# Altium project motor2.PrjPcb
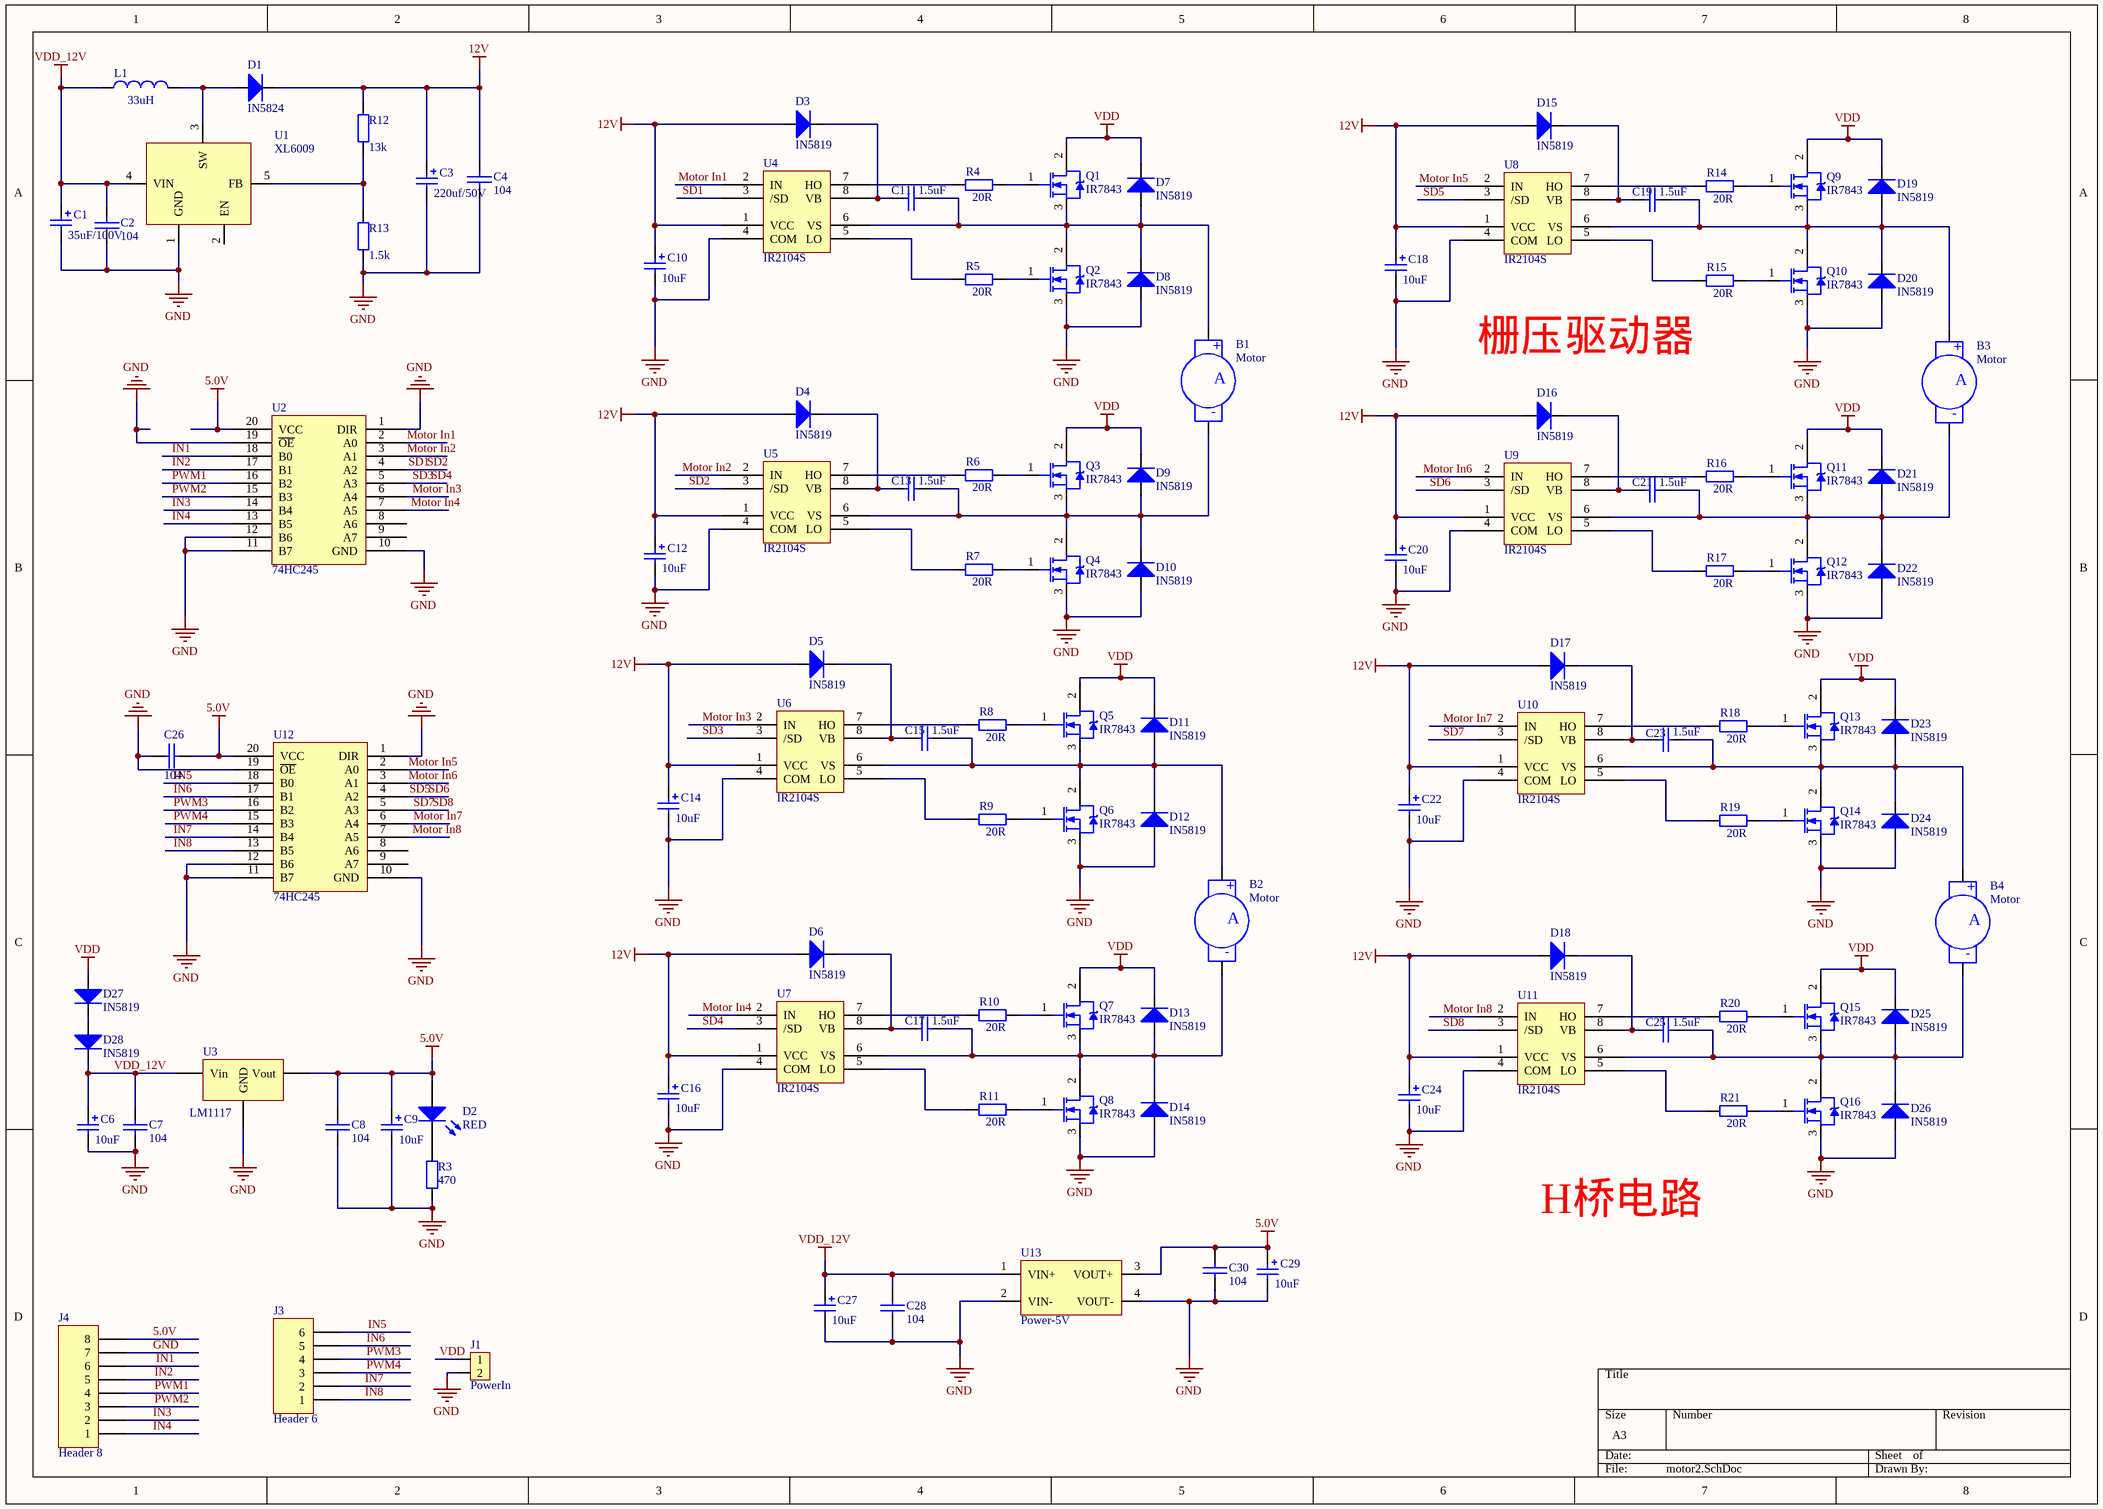
[diagram p0: motor2.SchDoc]
1 sheet, 113 parts. Net scope: global (net labels, ports and power ports of the same name join across sheets).
Board file: motor2.PcbDoc

## Sheet motor2.SchDoc
size A3

### Parts
B1  Motor  [Con 2接线端子]
B2  Motor  [Con 2接线端子]
B3  Motor  [Con 2接线端子]
B4  Motor  [Con 2接线端子]
C1  value 35uF/100V  [C6X12]  (hidden comment: Cap Pol1)
C2  104  [0805C]
C3  value 220uf/50V  [C8X12]  (hidden comment: Cap Pol1)
C4  104  [0805C]
C6  value 10uF  [3216]  (hidden comment: Cap Pol1)
C7  104  [0805c]
C8  104  [0805c]
C9  value 10uF  [3216]  (hidden comment: Cap Pol1)
C10  value 10uF  [3216]  (hidden comment: Cap Pol1)
C11  1.5uF  [0805C]
C12  value 10uF  [3216]  (hidden comment: Cap Pol1)
C13  1.5uF  [0805C]
C14  value 10uF  [3216]  (hidden comment: Cap Pol1)
C15  1.5uF  [0805C]
C16  value 10uF  [3216]  (hidden comment: Cap Pol1)
C17  1.5uF  [0805C]
C18  value 10uF  [3216]  (hidden comment: Cap Pol1)
C19  1.5uF  [0805C]
C20  value 10uF  [3216]  (hidden comment: Cap Pol1)
C21  1.5uF  [0805C]
C22  value 10uF  [3216]  (hidden comment: Cap Pol1)
C23  1.5uF  [0805C]
C24  value 10uF  [3216]  (hidden comment: Cap Pol1)
C25  1.5uF  [0805C]
C26  104  [0805C]
C27  value 10uF  [3216]  (hidden comment: Cap Pol1)
C28  104  [0805c]
C29  value 10uF  [3216]  (hidden comment: Cap Pol1)
C30  104  [0805c]
D1  IN5824  [DO-214  贴片二极管]
D2  RED  [3MM_LED]
D3  IN5819  [DO-214  贴片二极管]
D4  IN5819  [DO-214  贴片二极管]
D5  IN5819  [DO-214  贴片二极管]
D6  IN5819  [DO-214  贴片二极管]
D7  IN5819  [DO-214  贴片二极管]
D8  IN5819  [DO-214  贴片二极管]
D9  IN5819  [DO-214  贴片二极管]
D10  IN5819  [DO-214  贴片二极管]
D11  IN5819  [DO-214  贴片二极管]
D12  IN5819  [DO-214  贴片二极管]
D13  IN5819  [DO-214  贴片二极管]
D14  IN5819  [DO-214  贴片二极管]
D15  IN5819  [DO-214  贴片二极管]
D16  IN5819  [DO-214  贴片二极管]
D17  IN5819  [DO-214  贴片二极管]
D18  IN5819  [DO-214  贴片二极管]
D19  IN5819  [DO-214  贴片二极管]
D20  IN5819  [DO-214  贴片二极管]
D21  IN5819  [DO-214  贴片二极管]
D22  IN5819  [DO-214  贴片二极管]
D23  IN5819  [DO-214  贴片二极管]
D24  IN5819  [DO-214  贴片二极管]
D25  IN5819  [DO-214  贴片二极管]
D26  IN5819  [DO-214  贴片二极管]
D27  IN5819  [DO-214  贴片二极管]
D28  IN5819  [DO-214  贴片二极管]
J1  PowerIn  [T型公头]
J3  Header 6  [PH2.0-6P]
J4  Header 8  [PH2.0-8P]
L1  value 33uH  [L33uf]  (hidden comment: Inductor)
Q1  IR7843  [TO-252]
Q2  IR7843  [TO-252]
Q3  IR7843  [TO-252]
Q4  IR7843  [TO-252]
Q5  IR7843  [TO-252]
Q6  IR7843  [TO-252]
Q7  IR7843  [TO-252]
Q8  IR7843  [TO-252]
Q9  IR7843  [TO-252]
Q10  IR7843  [TO-252]
Q11  IR7843  [TO-252]
Q12  IR7843  [TO-252]
Q13  IR7843  [TO-252]
Q14  IR7843  [TO-252]
Q15  IR7843  [TO-252]
Q16  IR7843  [TO-252]
R3  value 470  [0603]  (hidden comment: Res2)
R4  value 20R  [0603]  (hidden comment: Res2)
R5  value 20R  [0603]  (hidden comment: Res2)
R6  value 20R  [0603]  (hidden comment: Res2)
R7  value 20R  [0603]  (hidden comment: Res2)
R8  value 20R  [0603]  (hidden comment: Res2)
R9  value 20R  [0603]  (hidden comment: Res2)
R10  value 20R  [0603]  (hidden comment: Res2)
R11  value 20R  [0603]  (hidden comment: Res2)
R12  value 13k  [0603]  (hidden comment: Res2)
R13  value 1.5k  [0603]  (hidden comment: Res2)
R14  value 20R  [0603]  (hidden comment: Res2)
R15  value 20R  [0603]  (hidden comment: Res2)
R16  value 20R  [0603]  (hidden comment: Res2)
R17  value 20R  [0603]  (hidden comment: Res2)
R18  value 20R  [0603]  (hidden comment: Res2)
R19  value 20R  [0603]  (hidden comment: Res2)
R20  value 20R  [0603]  (hidden comment: Res2)
R21  value 20R  [0603]  (hidden comment: Res2)
U1  XL6009  [TO-263]
U2  74HC245  [SOP20宽体]
U3  LM1117  [SOT-223]
U4  IR2104S  [SO8NB]
U5  IR2104S  [SO8NB]
U6  IR2104S  [SO8NB]
U7  IR2104S  [SO8NB]
U8  IR2104S  [SO8NB]
U9  IR2104S  [SO8NB]
U10  IR2104S  [SO8NB]
U11  IR2104S  [SO8NB]
U12  74HC245  [SOP20宽体]
U13  Power-5V  [Power]

### Nets
5.0V: C8.1 C9.1 C26.2 C29.1 C30.1 D2.1(A) J4.8 U2.20(VCC) U3.2(Vout) U12.20(VCC) U13.3(VOUT+)
12V: C3.1 C4.1 C10.1 C12.1 C14.1 C16.1 C18.1 C20.1 C22.1 C24.1 D1.2(K) D3.1(A) D4.1(A) D5.1(A) D6.1(A) D15.1(A) D16.1(A) D17.1(A) D18.1(A) R12.2 U4.1(VCC) U5.1(VCC) U6.1(VCC) U7.1(VCC) U8.1(VCC) U9.1(VCC) U10.1(VCC) U11.1(VCC)
GND: C1.2 C2.2 C3.2 C4.2 C6.2 C7.2 C8.2 C9.2 C10.2 C12.2 C14.2 C16.2 C18.2 C20.2 C22.2 C24.2 C26.1 C27.2 C28.2 C29.2 C30.2 D8.1(A) D10.1(A) D12.1(A) D14.1(A) D20.1(A) D22.1(A) D24.1(A) D26.1(A) J1.2 J4.7 Q2.3(S) Q4.3(S) Q6.3(S) Q8.3(S) Q10.3(S) Q12.3(S) Q14.3(S) Q16.3(S) R3.1 R13.1 U1.1(GND) U2.1(DIR) U2.10(GND) U2.11(B7) U2.12(B6) U2.19(~{OE}) U3.1(GND) U4.4(COM) U5.4(COM) U6.4(COM) U7.4(COM) U8.4(COM) U9.4(COM) U10.4(COM) U11.4(COM) U12.1(DIR) U12.10(GND) U12.11(B7) U12.12(B6) U12.19(~{OE}) U13.2(VIN-) U13.4(VOUT-)
VDD: D7.2(K) D9.2(K) D11.2(K) D13.2(K) D19.2(K) D21.2(K) D23.2(K) D25.2(K) D27.1(A) J1.1 Q1.2(D) Q3.2(D) Q5.2(D) Q7.2(D) Q9.2(D) Q11.2(D) Q13.2(D) Q15.2(D)
VDD_12V: C1.1 C2.1 C6.1 C7.1 C27.1 C28.1 D28.2(K) L1.1 U1.4(VIN) U3.3(Vin) U13.1(VIN+)
IN1: J4.6 U2.18(B0)
IN2: J4.5 U2.17(B1)
IN3: J4.2 U2.14(B4)
IN4: J4.1 U2.13(B5)
IN5: J3.6 U12.18(B0)
IN6: J3.5 U12.17(B1)
IN7: J3.2 U12.14(B4)
IN8: J3.1 U12.13(B5)
Motor In1: U2.2(A0) U4.2(IN)
Motor In2: U2.3(A1) U5.2(IN)
Motor In3: U2.6(A4) U6.2(IN)
Motor In4: U2.7(A5) U7.2(IN)
Motor In5: U8.2(IN) U12.2(A0)
Motor In6: U9.2(IN) U12.3(A1)
Motor In7: U10.2(IN) U12.6(A4)
Motor In8: U11.2(IN) U12.7(A5)
PWM1: J4.4 U2.16(B2)
PWM2: J4.3 U2.15(B3)
PWM3: J3.4 U12.16(B2)
PWM4: J3.3 U12.15(B3)
SD1: U2.4(A2) U4.3(/SD) U5.3(/SD)  [also labelled SD2]
SD3: U2.5(A3) U6.3(/SD) U7.3(/SD)  [also labelled SD4]
SD5: U8.3(/SD) U9.3(/SD) U12.4(A2)  [also labelled SD6]
SD7: U10.3(/SD) U11.3(/SD) U12.5(A3)  [also labelled SD8]
NetB1_1: B1.1(+) C11.1 D7.1(A) D8.2(K) Q1.3(S) Q2.2(D) U4.6(VS)
NetB1_2: B1.2(-) C13.1 D9.1(A) D10.2(K) Q3.3(S) Q4.2(D) U5.6(VS)
NetB2_1: B2.1(+) C15.1 D11.1(A) D12.2(K) Q5.3(S) Q6.2(D) U6.6(VS)
NetB2_2: B2.2(-) C17.1 D13.1(A) D14.2(K) Q7.3(S) Q8.2(D) U7.6(VS)
NetB3_1: B3.1(+) C19.1 D19.1(A) D20.2(K) Q9.3(S) Q10.2(D) U8.6(VS)
NetB3_2: B3.2(-) C21.1 D21.1(A) D22.2(K) Q11.3(S) Q12.2(D) U9.6(VS)
NetB4_1: B4.1(+) C23.1 D23.1(A) D24.2(K) Q13.3(S) Q14.2(D) U10.6(VS)
NetB4_2: B4.2(-) C25.1 D25.1(A) D26.2(K) Q15.3(S) Q16.2(D) U11.6(VS)
NetC11_2: C11.2 D3.2(K) U4.8(VB)
NetC13_2: C13.2 D4.2(K) U5.8(VB)
NetC15_2: C15.2 D5.2(K) U6.8(VB)
NetC17_2: C17.2 D6.2(K) U7.8(VB)
NetC19_2: C19.2 D15.2(K) U8.8(VB)
NetC21_2: C21.2 D16.2(K) U9.8(VB)
NetC23_2: C23.2 D17.2(K) U10.8(VB)
NetC25_2: C25.2 D18.2(K) U11.8(VB)
NetD1_1: D1.1(A) L1.2 U1.3(SW)
NetD2_2: D2.2(K) R3.2
NetD27_2: D27.2(K) D28.1(A)
NetQ1_1: Q1.1(G) R4.2
NetQ2_1: Q2.1(G) R5.2
NetQ3_1: Q3.1(G) R6.2
NetQ4_1: Q4.1(G) R7.2
NetQ5_1: Q5.1(G) R8.2
NetQ6_1: Q6.1(G) R9.2
NetQ7_1: Q7.1(G) R10.2
NetQ8_1: Q8.1(G) R11.2
NetQ9_1: Q9.1(G) R14.2
NetQ10_1: Q10.1(G) R15.2
NetQ11_1: Q11.1(G) R16.2
NetQ12_1: Q12.1(G) R17.2
NetQ13_1: Q13.1(G) R18.2
NetQ14_1: Q14.1(G) R19.2
NetQ15_1: Q15.1(G) R20.2
NetQ16_1: Q16.1(G) R21.2
NetR4_1: R4.1 U4.7(HO)
NetR5_1: R5.1 U4.5(LO)
NetR6_1: R6.1 U5.7(HO)
NetR7_1: R7.1 U5.5(LO)
NetR8_1: R8.1 U6.7(HO)
NetR9_1: R9.1 U6.5(LO)
NetR10_1: R10.1 U7.7(HO)
NetR11_1: R11.1 U7.5(LO)
NetR12_1: R12.1 R13.2 U1.5(FB)
NetR14_1: R14.1 U8.7(HO)
NetR15_1: R15.1 U8.5(LO)
NetR16_1: R16.1 U9.7(HO)
NetR17_1: R17.1 U9.5(LO)
NetR18_1: R18.1 U10.7(HO)
NetR19_1: R19.1 U10.5(LO)
NetR20_1: R20.1 U11.7(HO)
NetR21_1: R21.1 U11.5(LO)

Not connected (* = marked no-connect by the designer): U1 2(EN); U2 8(A6) 9(A7); U12 8(A6) 9(A7)

### Notes on the sheet
- 栅压驱动器
- H桥电路
- (in symbol Motor Servo) A

### Library data of the parts
B1-B4 = Motor Servo: Servo Motor
C1 C3 C6 C9 C10 C12 C14 C16 C18 C20 C22 C24 C27 C29 = Cap Pol1: Polarized Capacitor (Radial); Published: 8-Jun-2000; LatestRevisionDate: 17-Jul-2002; LatestRevisionNote: Re-released for DXP Platform.; PackageReference: RB7.6-15; Publisher: Altium Limited; PackageDescription: Polarized Capacitor (Radial); 2 Leads
C2 C4 C7 C8 C11 C13 C15 C17 C19 C21 C23 C25 C26 C28 C30 = Cap: Capacitor
D1 D3-D28 = Diode: Default Diode; PackageVersion: Sep-1996; PackageDescription: DO-214-AB/SMC; 2 C-Bend Leads; Body 7.9 x 5.9 mm, inc. leads (LxW); Code_JEDEC: DO-214-AB
D2 = LED2: Typical RED, GREEN, YELLOW, AMBER GaAs LED; Published: 8-Jun-2000; LatestRevisionDate: 17-Jul-2002; LatestRevisionNote: Re-released for DXP Platform.; PackageVersion: Feb-2002; PackageReference: 3.2X1.6X1.1; Publisher: Altium Limited; PackageDescription: SM LED; 2 Flat Leads
J1 = Header 2: Header, 2-Pin
J3 = Header 6: Header, 6-Pin; LatestRevisionDate: 17-Jul-2002; LatestRevisionNote: Re-released for DXP Platform.; Publisher: Altium Limited
J4 = Header 8: Header, 8-Pin; LatestRevisionDate: 17-Jul-2002; LatestRevisionNote: Re-released for DXP Platform.; Publisher: Altium Limited
L1 = Inductor: Code_IEC: 1005; Published: 8-Jun-2000; LatestRevisionDate: 29-May-2009; LatestRevisionNote: IPC-7351 Footprint Added.; PackageReference: 0402-A; Publisher: Altium Limited; PackageDescription: Chip Inductor; Code_JEITA: 0402
Q1-Q16 = NMOS-2: N-Channel Power MOSFET; Note: Pin 2 is electrically connected to pin 4.; Published: 8-Jun-2000; LatestRevisionDate: 17-Jul-2002; LatestRevisionNote: Re-released for DXP Platform.; DatasheetVersion: PD-9.814; PackageVersion: Feb-1997; PackageReference: TO-220AB; Publisher: Altium Limited; PackageDescription: TO, Thru-Hole, Vertical, Heatsink Mounted; 3 In-Line Leads; Pitch 2.54 mm; ComponentLink1Description: Manufacturer Link; ComponentLink1URL: http://www.irf.com/
R3-R21 = Res2: Resistor; Published: 8-Jun-2000; LatestRevisionDate: 17-Jul-2002; LatestRevisionNote: Re-released for DXP Platform.; PackageReference: AXIAL-0.4; Publisher: Altium Limited; PackageDescription: Axial Device, Thru-Hole; 2 Leads; 0.4 in Pin Spacing
U2 U12 = 74lvc245: 8位5伏转3.3伏电平转换芯片
U3 = ASM1117
U13 = Power